# Altium schematic sheet Data Acquisition Schematic.SchDoc
size A
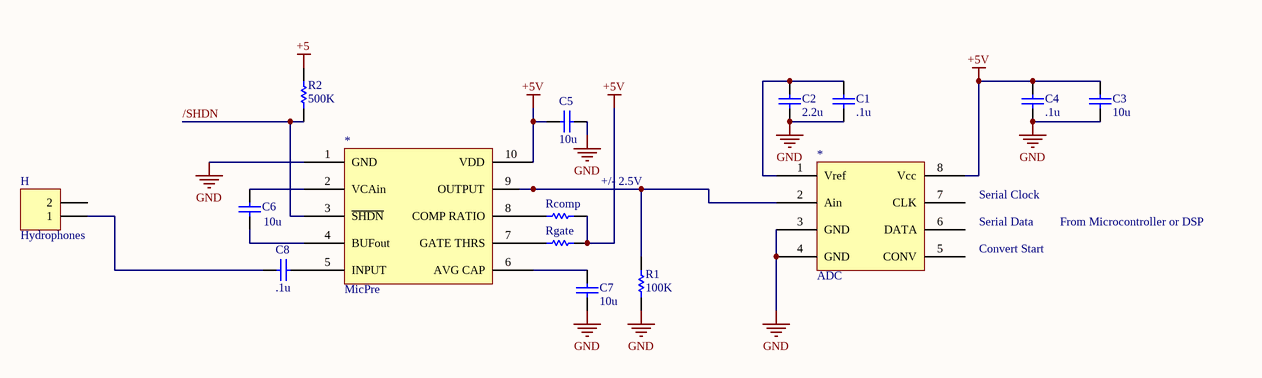
[diagram p0: Data Acquisition Schematic.SchDoc]

## Parts
(Parts that share a designator on the sheet are numbered #1, #2 ... from top to bottom, then left to right.)
*#1  MicPre
*#2  ADC
C1  .1u  [RAD-0.3]
C2  2.2u  [RAD-0.3]
C3  10u  [RAD-0.3]
C4  .1u  [RAD-0.3]
C5  10u  [RAD-0.3]
C6  value 10u  [RAD-0.3]
C7  10u  [RAD-0.3]
C8  .1u  [RAD-0.3]
H  Hydrophones  [HDR1X2]
R1  100K  [AXIAL-0.3]
R2  500K  [AXIAL-0.3]
Rcomp  (no value)  [AXIAL-0.3]
Rgate  (no value)  [AXIAL-0.3]

## Nets
+5: R2.1
+5V: *#1.10(VDD) *#2.8(Vcc) C3.1 C4.1 C5.1 Rcomp.2 Rgate.2
GND: *#1.1(GND) *#2.3(GND) *#2.4(GND) C1.2 C2.2 C3.2 C4.2 C5.2 C7.2 R1.2
/SHDN: *#1.3(~{SHDN}) R2.2  [also labelled \]
Net*#1_2: *#1.2(VCAin) C6.1
Net*#1_4: *#1.4(BUFout) C6.2
Net*#1_5: *#1.5(INPUT) C8.2
Net*#1_6: *#1.6(AVG_CAP) C7.1
Net*#1_7: *#1.7(GATE_THRS) Rgate.1
Net*#1_8: *#1.8(COMP_RATIO) Rcomp.1
Net*#1_9: *#1.9(OUTPUT) *#2.2(Ain) R1.1
Net*#2_1: *#2.1(Vref) C1.1 C2.1
NetC8_1: C8.1 H.1

Not connected (* = marked no-connect by the designer): *#2 5(CONV) 6(DATA) 7(CLK); H 2

## Notes on the sheet
- +/- 2.5V
- Serial Clock
- Serial Data
- Convert Start
- From Microcontroller or DSP

## Library data of the parts
C1-C8 = Cap: Capacitor; Published: 8-Jun-2000; LatestRevisionDate: 17-Jul-2002; LatestRevisionNote: Re-released for DXP Platform.; PackageReference: RAD-0.3; Publisher: Altium Limited; PackageDescription: Radial Cap, Thru-Hole; 2 Leads; 0.3 in Pin Spacing
H = Header 2: Header, 2-Pin; LatestRevisionDate: 17-Jul-2002; LatestRevisionNote: Re-released for DXP Platform.; Publisher: Altium Limited
R1 R2 Rcomp = Res1: Resistor; Published: 8-Jun-2000; LatestRevisionDate: 17-Jul-2002; LatestRevisionNote: Re-released for DXP Platform.; PackageReference: AXIAL-0.3; Publisher: Altium Limited; PackageDescription: Axial Device, Thru-Hole; 2 Leads; 0.3 in Pin Spacing
Rgate = Res1: Resistor; Value: 1K; Published: 8-Jun-2000; LatestRevisionDate: 17-Jul-2002; LatestRevisionNote: Re-released for DXP Platform.; PackageReference: AXIAL-0.3; Publisher: Altium Limited; PackageDescription: Axial Device, Thru-Hole; 2 Leads; 0.3 in Pin Spacing